# Altium schematic sheet sch_mcu.SchDoc
size A4
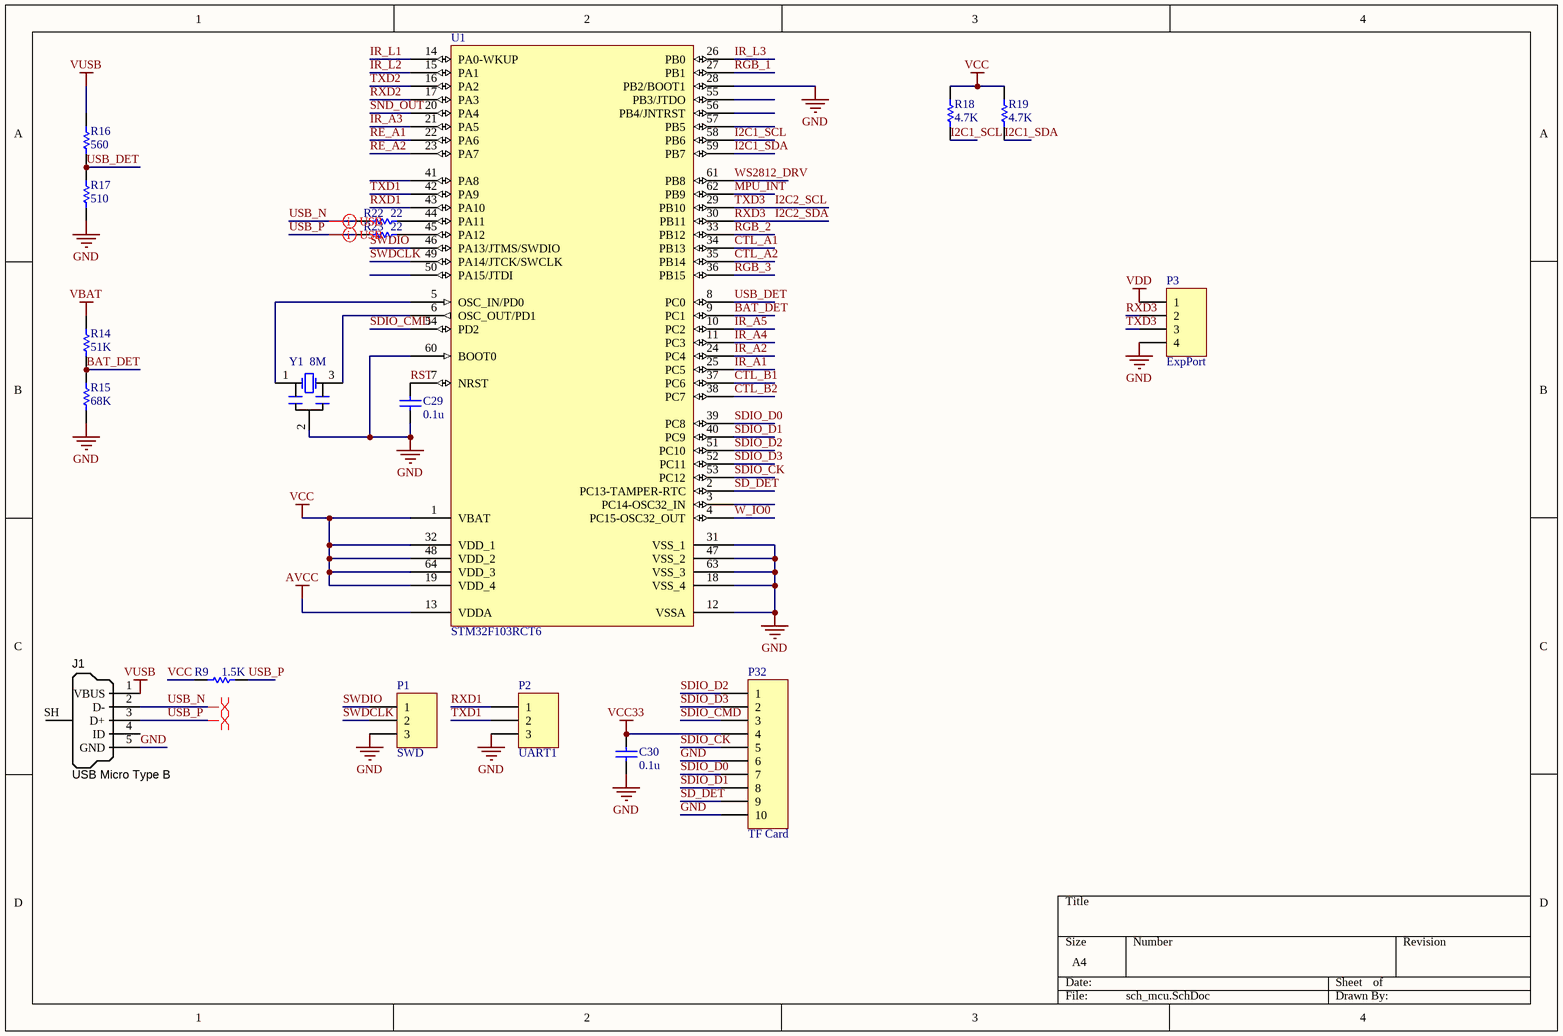
[diagram p0: sch_mcu.SchDoc]

## Parts
C29  value 0.1u  [C-1608[0603]]  (hidden comment: Cap Semi)
C30  value 0.1u  [C-1608[0603]]  (hidden comment: Cap Semi)
J1  USB Micro Type B  [MICRO USB 3D]
P1  SWD  [HDR1X3]
P2  UART1  [HDR1X3]
P3  ExpPort  [HDR1X4]
P32  TF Card  [MicroSD auto]
R9  value 1.5K  [R-1608[0603]]  (hidden comment: Res Semi)
R14  value 51K  [R-1608[0603]]  (hidden comment: Res Semi)
R15  value 68K  [R-1608[0603]]  (hidden comment: Res Semi)
R16  value 560  [R-1608[0603]]  (hidden comment: Res Semi)
R17  value 510  [R-1608[0603]]  (hidden comment: Res Semi)
R18  value 4.7K  [R-1608[0603]]  (hidden comment: Res Semi)
R19  value 4.7K  [R-1608[0603]]  (hidden comment: Res Semi)
R22  value 22  [R-1608[0603]]  (hidden comment: Res Semi)
R23  value 22  [R-1608[0603]]  (hidden comment: Res Semi)
U1  STM32F103RCT6  [TQFP64_N-3D]
Y1  8M  [Crystal_C]

## Nets
AVCC: U1.13(VDDA)
GND: C29.1 C30.1 J1.5(GND) P1.3 P2.3 P3.4 P32.6 P32.10 R15.2 R17.1 U1.12(VSSA) U1.18(VSS_4) U1.28(PB2/BOOT1) U1.31(VSS_1) U1.47(VSS_2) U1.60(BOOT0) U1.63(VSS_3) Y1.2(GND)
VBAT: R14.2
VCC: R9.2 R18.2 R19.2 U1.1(VBAT) U1.19(VDD_4) U1.32(VDD_1) U1.48(VDD_2) U1.64(VDD_3)
VCC33: C30.2 P32.4
VDD: P3.1
VUSB: J1.1(VBUS) R16.2
BAT_DET: R14.1 R15.1 U1.9(PC1)
CTL_A1: U1.34(PB13)
CTL_A2: U1.35(PB14)
CTL_B1: U1.37(PC6)
CTL_B2: U1.38(PC7)
I2C1_SCL: R18.1 U1.58(PB6)
I2C1_SDA: R19.1 U1.59(PB7)
I2C2_SCL: P3.3 U1.29(PB10)  [also labelled TXD3]
I2C2_SDA: P3.2 U1.30(PB11)  [also labelled RXD3]
IR_A1: U1.25(PC5)
IR_A2: U1.24(PC4)
IR_A3: U1.21(PA5)
IR_A4: U1.11(PC3)
IR_A5: U1.10(PC2)
IR_L1: U1.14(PA0-WKUP)
IR_L2: U1.15(PA1)
IR_L3: U1.26(PB0)
MPU_INT: U1.62(PB9)
RE_A1: U1.22(PA6)
RE_A2: U1.23(PA7)
RGB_1: U1.27(PB1)
RGB_2: U1.33(PB12)
RGB_3: U1.36(PB15)
RST: C29.2 U1.7(NRST)
RXD1: P2.1 U1.43(PA10)
RXD2: U1.17(PA3)
SD_DET: P32.9 U1.2(PC13-TAMPER-RTC)
SDIO_CK: P32.5 U1.53(PC12)
SDIO_CMD: P32.3 U1.54(PD2)
SDIO_D0: P32.7 U1.39(PC8)
SDIO_D1: P32.8 U1.40(PC9)
SDIO_D2: P32.1 U1.51(PC10)
SDIO_D3: P32.2 U1.52(PC11)
SND_OUT: U1.20(PA4)
SWDCLK: P1.2 U1.49(PA14/JTCK/SWCLK)
SWDIO: P1.1 U1.46(PA13/JTMS/SWDIO)
TXD1: P2.2 U1.42(PA9)
TXD2: U1.16(PA2)
USB_DET: R16.1 R17.2 U1.8(PC0)
USB_N: J1.2(D-) R22.1
USB_P: J1.3(D+) R9.1 R23.1
W_IO0: U1.4(PC15-OSC32_OUT)
WS2812_DRV: U1.61(PB8)
NetR22_2: R22.2 U1.44(PA11)
NetR23_2: R23.2 U1.45(PA12)
NetU1_5: U1.5(OSC_IN/PD0) Y1.1(OSC1)
NetU1_6: U1.6(OSC_OUT/PD1) Y1.3(OSC2)

Not connected (* = marked no-connect by the designer): J1 4(ID) SH(Shell); U1 3(PC14-OSC32_IN) 41(PA8) 50(PA15/JTDI) 55(PB3/JTDO) 56(PB4/JNTRST) 57(PB5)

## Layout directives
differential pair: USB_N, USB_P

## Library data of the parts
C29 C30 = Cap Semi: Capacitor (Semiconductor SIM Model); Published: 8-Jun-2000; LatestRevisionDate: 17-Jul-2002; LatestRevisionNote: Re-released for DXP Platform.; PackageReference: C1206; Publisher: Altium Limited
J1 = USB_Micro_TypeB: Connector SMD USB Micro Type B middle mount; Manufacturer 1: Molex Inc; Manufacturer Part Number 1: 47491-0001; SCDType: undef; Package / Case: SMD; Supplier 1: Digi-Key; Supplier Part Number 1: WM17142CT-ND
P1 P2 = Header 3: Header, 3-Pin; LatestRevisionDate: 17-Jul-2002; LatestRevisionNote: Re-released for DXP Platform.; Publisher: Altium Limited
P3 = Header 4: Header, 4-Pin; LatestRevisionDate: 17-Jul-2002; LatestRevisionNote: Re-released for DXP Platform.; Publisher: Altium Limited
P32 = Header 10: Header, 10-Pin; LatestRevisionDate: 17-Jul-2002; LatestRevisionNote: Re-released for DXP Platform.; Publisher: Altium Limited
R9 R14-R19 R22 R23 = Res Semi: Semiconductor Resistor; Published: 8-Jun-2000; LatestRevisionDate: 17-Jul-2002; LatestRevisionNote: Re-released for DXP Platform.; PackageReference: AXIAL-0.5; Publisher: Altium Limited
U1 = STM32F103RBT6: STM32 ARM-based 32-bit MCU High-density; Published: 30-May-2008; DatasheetVersion: rev6, Mar-2008; PackageVersion: Mar-2008; PackageReference: LQFP64; Publisher: Altium Limited; PackageDescription: 64-Pin Low-Profile Quad Flat Pack, 10 x 10 mm Body, 0.5 mm Pitch (LQFP64); ComponentLink1Description: Manufacturer Link; ComponentLink1URL: www.st.com/stm32; ComponentLink2Description: Datasheet; ComponentLink2URL: http://www.st.com/stonline/products/literature/ds/13587.pdf
Y1 = XTAL_C: Crystal Oscillator; Published: 8-Jun-2000; LatestRevisionDate: 17-Jul-2002; LatestRevisionNote: Re-released for DXP Platform.; PackageReference: R38; Publisher: Altium Limited